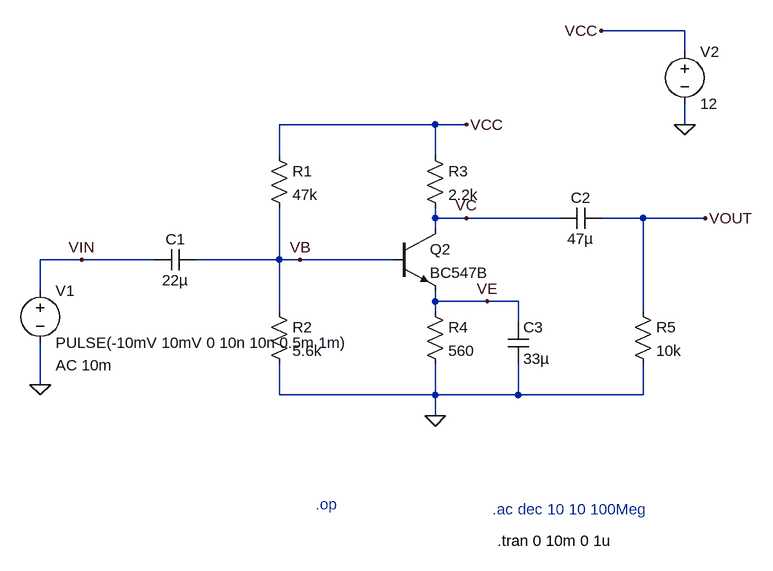
[diagram p0: schematic Demo_BJT_CE_Amplifier.asc]
Demo_BJT_CE_Amplifier.asc, the LTspice schematic file:
Version 4.1
SHEET 1 880 680
WIRE 512 -208 384 -208
WIRE 512 -176 512 -208
WIRE 128 -64 -112 -64
WIRE 176 -64 128 -64
WIRE 512 -64 512 -96
WIRE -112 -16 -112 -64
WIRE 128 -16 128 -64
WIRE 128 80 128 64
WIRE 176 80 128 80
WIRE 320 80 176 80
WIRE 448 80 384 80
WIRE 544 80 448 80
WIRE 128 96 128 80
WIRE -416 144 -480 144
WIRE -304 144 -416 144
WIRE -112 144 -112 64
WIRE -112 144 -240 144
WIRE -80 144 -112 144
WIRE 64 144 -80 144
WIRE -480 192 -480 144
WIRE 128 208 128 192
WIRE 208 208 128 208
WIRE 256 208 208 208
WIRE -112 224 -112 144
WIRE 128 224 128 208
WIRE 448 224 448 80
WIRE 256 240 256 208
WIRE -480 336 -480 272
WIRE -112 352 -112 304
WIRE 128 352 128 304
WIRE 128 352 -112 352
WIRE 256 352 256 304
WIRE 256 352 128 352
WIRE 448 352 448 304
WIRE 448 352 256 352
WIRE 128 384 128 352
FLAG -480 336 0
FLAG 512 -64 0
FLAG 128 384 0
FLAG 384 -208 VCC
FLAG 176 -64 VCC
FLAG 544 80 VOUT
FLAG -416 144 VIN
FLAG 208 208 VE
FLAG 176 80 VC
FLAG -80 144 VB
SYMBOL res -128 -32 R0
SYMATTR InstName R1
SYMATTR Value 47k
SYMBOL res -128 208 R0
SYMATTR InstName R2
SYMATTR Value 5.6k
SYMBOL res 112 -32 R0
SYMATTR InstName R3
SYMATTR Value 2.2k
SYMBOL res 112 208 R0
SYMATTR InstName R4
SYMATTR Value 560
SYMBOL res 432 208 R0
SYMATTR InstName R5
SYMATTR Value 10k
SYMBOL voltage -480 176 R0
WINDOW 123 24 130 Left 2
WINDOW 39 0 0 Left 0
SYMATTR Value2 AC 10m
SYMATTR InstName V1
SYMATTR Value PULSE(-10mV 10mV 0 10n 10n 0.5m 1m)
SYMBOL cap -304 160 R270
WINDOW 0 32 32 VTop 2
WINDOW 3 0 32 VBottom 2
SYMATTR InstName C1
SYMATTR Value 22µ
SYMBOL cap 320 96 R270
WINDOW 0 32 32 VTop 2
WINDOW 3 0 32 VBottom 2
SYMATTR InstName C2
SYMATTR Value 47µ
SYMBOL cap 240 240 R0
SYMATTR InstName C3
SYMATTR Value 33µ
SYMBOL voltage 512 -192 R0
WINDOW 123 0 0 Left 0
WINDOW 39 0 0 Left 0
SYMATTR InstName V2
SYMATTR Value 12
SYMBOL npn 64 96 R0
SYMATTR InstName Q2
SYMATTR Value BC547B
TEXT 224 576 Left 2 !.tran 0 10m 0 1u
TEXT -56 520 Left 2 ;.op
TEXT 216 528 Left 2 ;.ac dec 10 10 100Meg

The netlist it stands for:
* Demo_BJT_CE_Amplifier.asc
R1 VCC VB 47k
R2 VB 0 5.6k
R3 VCC VC 2.2k
R4 VE 0 560
R5 VOUT 0 10k
V1 VIN 0 PULSE(-10mV 10mV 0 10n 10n 0.5m 1m) AC 10m
C1 VIN VB 22µ
C2 VC VOUT 47µ
C3 VE 0 33µ
V2 VCC 0 12
Q2 VC VB VE 0 BC547B
.model NPN NPN
.model PNP PNP
.lib standard.bjt
.tran 0 10m 0 1u
* .op
* .ac dec 10 10 100Meg
.backanno
.end